# EAGLE design SECAM-TDA (EAGLE 6.4)
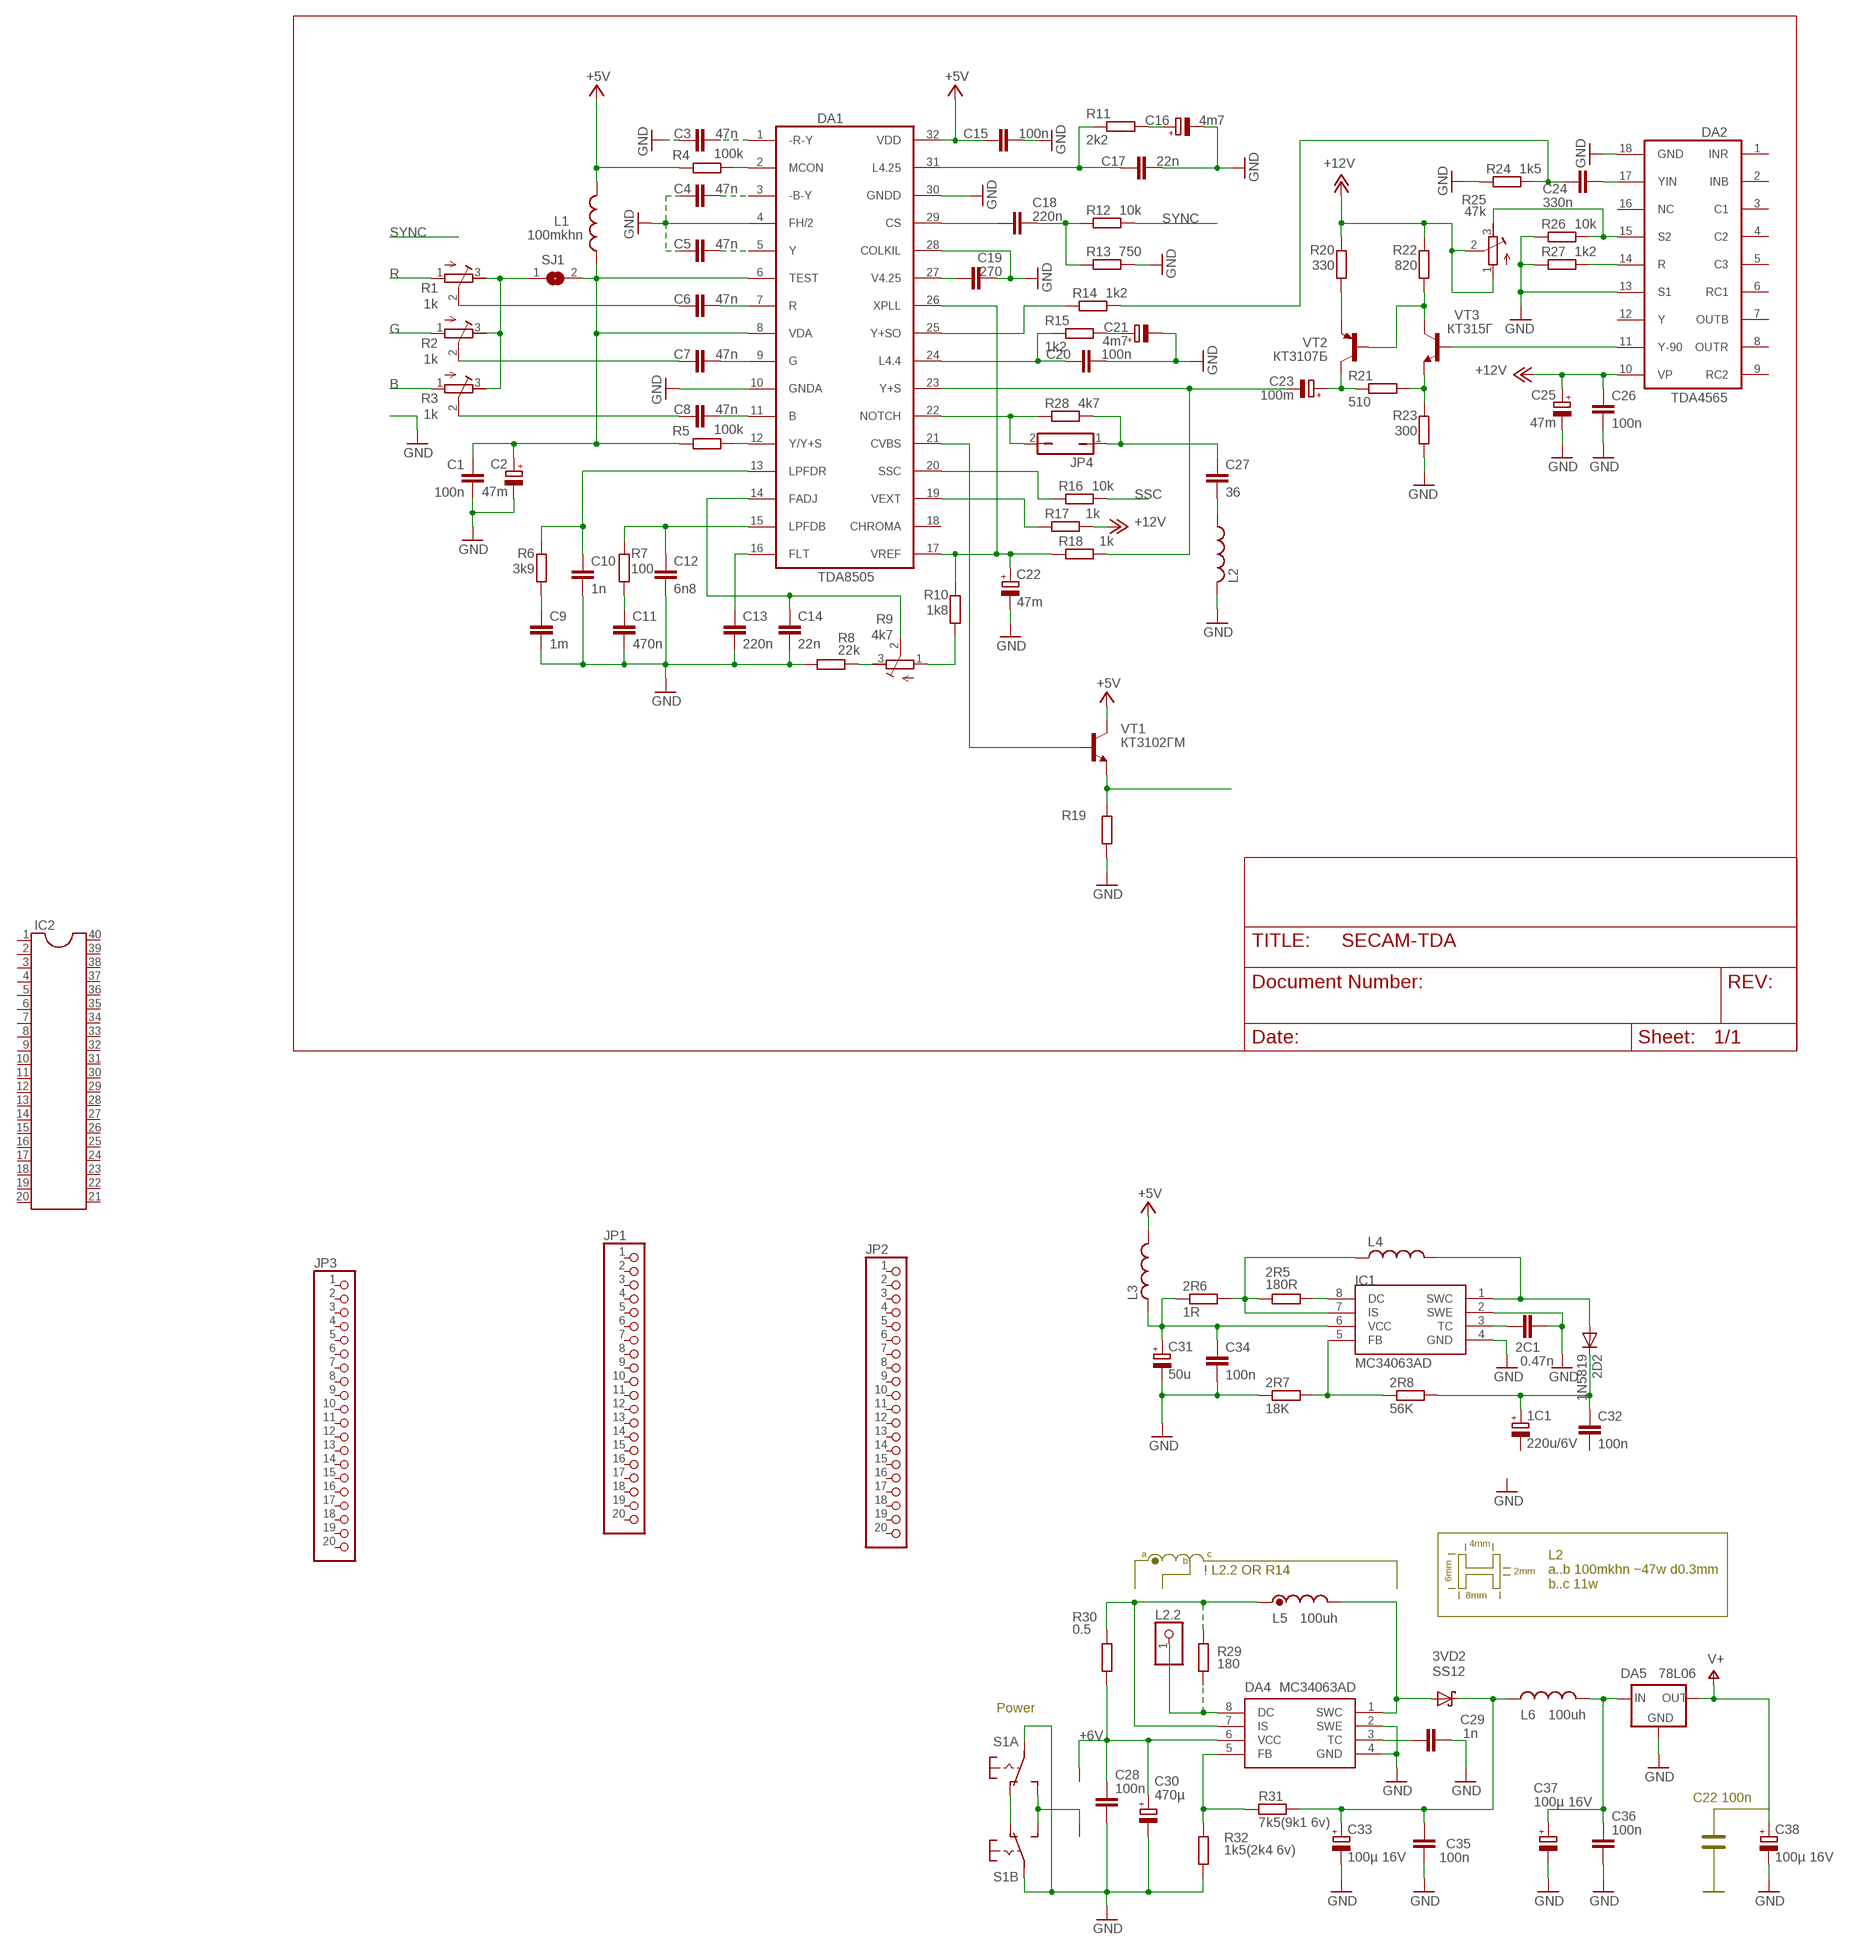
[diagram p0: schematic, sheet 1]

## Parts
1C1  220u/6V  CPOL-EUE3.5-8  [E3,5-8]
2C1  0.47n  C-EUC0805K  [C0805K]
2D2  1N5819  DIODE-SMB  [SMB]
2R5  180R  R-EU_R0805  [R0805]
2R6  1R  R-EU_R0805  [R0805]
2R7  18K  R-EU_R0805  [R0805]
2R8  56K  R-EU_R0805  [R0805]
3VD2  SS12  SCHOTTKY-DIODESMD  [SMB]
C1  100n  C-EUC0805  [C0805]
C2  47m  CPOL-EUE2.5-5  [E2,5-5]
C3  47n  C-EU025-025X050  [C025-025X050]
C4  47n  C-EU025-025X050  [C025-025X050]
C5  47n  C-EU025-025X050  [C025-025X050]
C6  47n  C-EU025-025X050  [C025-025X050]
C7  47n  C-EU025-025X050  [C025-025X050]
C8  47n  C-EU025-025X050  [C025-025X050]
C9  1m  C-EU025-025X050  [C025-025X050]
C10  1n  C-EU025-025X050  [C025-025X050]
C11  470n  C-EU025-025X050  [C025-025X050]
C12  6n8  C-EU025-025X050  [C025-025X050]
C13  220n  C-EU025-025X050  [C025-025X050]
C14  22n  C-EU025-025X050  [C025-025X050]
C15  100n  C-EUC0805  [C0805]
C16  4m7  CPOL-EUE2.5-5  [E2,5-5]
C17  22n  C-EU025-025X050  [C025-025X050]
C18  220n  C-EU025-025X050  [C025-025X050]
C19  270  C-EU025-025X050  [C025-025X050]
C20  100n  C-EUC0805  [C0805]
C21  4m7  CPOL-EUE2.5-5  [E2,5-5]
C22  47m  CPOL-EUE2.5-5  [E2,5-5]
C23  100m  CPOL-EUE2.5-5  [E2,5-5]
C24  330n  C-EU025-025X050  [C025-025X050]
C25  47m  CPOL-EUE2.5-5  [E2,5-5]
C26  100n  C-EUC0805  [C0805]
C27  36  C-EUC0805  [C0805]
C28  100n  C-EUC0805  [C0805]
C29  1n  C-EUC0805  [C0805]
C30  470µ  RCL_CPOL-EUE2.5-7  [RCL_E2,5-7]
C31  50u  CPOL-EUE2.5-6  [E2,5-6]
C32  100n  C-EUC0805K  [C0805K]
C33  100µ 16V  RCL_CPOL-EUE2.5-5  [RCL_E2,5-5]
C34  100n  C-EUC0805K  [C0805K]
C35  100n  C-EUC0805  [C0805]
C36  100n  C-EUC0805  [C0805]
C37  100µ 16V  RCL_CPOL-EUE2.5-5  [RCL_E2,5-5]
C38  100µ 16V  RCL_CPOL-EUE2.5-5  [RCL_E2,5-5]
DA1  TDA8505  [PDIP32]
DA2  TDA4565  [DIL18]
DA4  MC34063AD  [SOIC8]
DA5  78L06  78LXX_SOT89  [SOT89R]
IC1  MC34063AD  [SOIC8]
IC2  DIL40  [DIL40]
JP1  PINHD-1X20  [1X20]
JP2  PINHD-1X20  [1X20]
JP3  PINHD-1X20  [1X20]
JP4  JP1Q  [JP1]
L1  100mkhn  L-US0207/10  [0207/10]
L2  L0204/5  [0204/5]
L2.2  PINHD-1X1  [1X01]
L3  L0204/7  [0204/7]
L4  L0204/7  [0204/7]
L5  100uh  L-US0204/7  [0204/7]
L6  100uh  L-US0207/10  [0207/10]
R1  1k  R-TRIMM3296W  [RTRIM3296W]
R2  1k  R-TRIMM3296W  [RTRIM3296W]
R3  1k  R-TRIMM3296W  [RTRIM3296W]
R4  100k  R-EU_R0805  [R0805]
R5  100k  R-EU_0204/7  [0204/7]
R6  3k9  R-EU_R0805  [R0805]
R7  100  R-EU_0204/7  [0204/7]
R8  22k  R-EU_R0805  [R0805]
R9  4k7  R-TRIMM3296W  [RTRIM3296W]
R10  1k8  R-EU_R0805  [R0805]
R11  2k2  R-EU_R0805  [R0805]
R12  10k  R-EU_R0805  [R0805]
R13  750  R-EU_R0805  [R0805]
R14  1k2  R-EU_0207/10  [0207/10]
R15  1k2  R-EU_R0805  [R0805]
R16  10k  R-EU_R0805  [R0805]
R17  1k  R-EU_R0805  [R0805]
R18  1k  R-EU_R0805  [R0805]
R19  R-EU_R0805  [R0805]
R20  330  R-EU_R0805  [R0805]
R21  510  R-EU_R0805  [R0805]
R22  820  R-EU_R0805  [R0805]
R23  300  R-EU_R0805  [R0805]
R24  1k5  R-EU_R0805  [R0805]
R25  47k  R-TRIMM3296W  [RTRIM3296W]
R26  10k  R-EU_R0805  [R0805]
R27  1k2  R-EU_R0805  [R0805]
R28  4k7  R-EU_R0805  [R0805]
R29  180  R-EU_M0805  [M0805]
R30  0.5  R-EU_M1206  [M1206]
R31  7k5(9k1 6v)  R-EU_M0805  [M0805]
R32  1k5(2k4 6v)  R-EU_M0805  [M0805]
S1  SWITCH9X4  [SWITCH9X4]
SJ1  SJ  [SJ]
U$5  B-  [B-]
U$6  B+  [B+]
VT1  КТ3102ГМ  -NPN-TO92-EBC  [TO92-EBC]
VT2  КТ3107Б  BC369  [TO92-BCE]
VT3  КТ315Г  -NPN-TO92-ECB  [TO92-ECB]

## Nets
+5V: C15.1 DA1.32(VDD) L1.2 L3.2 R4.1 VT1.C
+6V: C28.1 C30.+ DA4.6(VCC) R30.1 U$6.P$1
+12V: C25.+ C26.1 DA2.10(VP) R17.2 R20.2 R22.2 R25.1(A) R25.2(S)
B: R3.1(A)
G: R2.1(A)
GND: 2C1.2 2R7.1 C1.2 C2.- C3.1 C4.1 C5.1 C9.2 C10.2 C11.2 C12.2 C13.2 C14.2 C15.2 C16.- C17.2 C19.2 C20.2 C21.- C22.- C25.- C26.2 C28.2 C29.2 C30.- C31.- C33.- C34.2 C35.1 C36.2 C37.- C38.- DA1.4(FH/2) DA1.10(GNDA) DA1.28(COLKIL) DA1.30(GNDD) DA2.13(S1) DA2.18(GND) DA4.2(SWE) DA4.4(GND) DA5.3(GND) DA5.4(GND) IC1.2(SWE) IC1.4(GND) L2.1 R8.1 R13.2 R19.1 R23.1 R24.1 R26.1 R27.1 R32.1 S1.10(A:P) S1.20(B:P)
N$1: C3.2 DA1.1(-R-Y)
N$2: DA1.2(MCON) R4.2
N$3: C24.2 DA2.17(YIN)
N$4: C4.2 DA1.3(-B-Y)
N$5: C5.2 DA1.5(Y)
N$6: C1.1 C2.+ DA1.6(TEST) DA1.8(VDA) L1.1 R5.1 SJ1.2
N$7: C6.1 R1.2(S)
N$8: C6.2 DA1.7(R)
N$9: C11.1 R7.1
N$10: C7.1 R2.2(S)
N$11: C7.2 DA1.9(G)
N$12: C8.2 DA1.11(B)
N$13: C8.1 R3.2(S)
N$14: DA1.12(Y/Y+S) R5.2
N$15: C13.1 DA1.16(FLT)
N$16: C10.1 DA1.13(LPFDR) R6.2
N$17: R8.2 R9.3(E)
N$18: C9.1 R6.1
N$19: C12.1 DA1.15(LPFDB) R7.2
N$20: C14.1 DA1.14(FADJ) R9.2(S)
N$21: C22.+ DA1.17(VREF) DA1.26(XPLL) R10.2 R18.1
N$22: C19.1 DA1.27(V4.25)
N$23: R9.1(A) R10.1
N$25: DA1.19(VEXT) R17.1
N$26: DA1.20(SSC) R16.1
N$27: DA1.21(CVBS) VT1.B
N$28: C23.- DA1.23(Y+S) R18.2
N$29: C20.1 DA1.24(L4.4) R15.1
N$30: C21.+ R15.2
N$31: C17.1 DA1.31(L4.25) R11.1
N$32: C24.1 R14.2 R24.2
N$33: DA1.25(Y+SO) R14.1
N$34: C16.+ R11.2
N$35: DA2.14(R) R27.2
N$36: DA2.15(S2) R25.3(E) R26.2
N$37: C18.1 DA1.29(CS)
N$38: C18.2 R12.1 R13.1
N$39: DA2.11(Y-90) VT3.B
N$40: R22.1 VT2.B VT3.C
N$41: R20.1 VT2.E
N$43: R21.2 R23.2 VT3.E
N$44: C23.+ R21.1 VT2.C
N$45: R19.2 VT1.E
N$47: C27.1 JP4.1 R28.2
N$48: R1.3(E) R2.3(E) R3.3(E) SJ1.1
N$49: DA1.22(NOTCH) JP4.2 R28.1
N$50: 2C1.1 IC1.3(TC)
N$51: 2D2.A IC1.1(SWC) L4.2
N$52: 2R5.1 2R6.2 IC1.7(IS) L4.1
N$53: 2R5.2 IC1.8(DC)
N$54: 2R7.2 2R8.1 IC1.5(FB)
N$55: DA4.8(DC) L2.2.1 R29.1
N$56: 1C1.+ 2D2.C 2R8.2 C32.1
N$57: 2R6.1 C31.+ C34.1 IC1.6(VCC) L3.1
N$58: C27.2 L2.2
N$59: DA4.7(IS) L5.1 R29.2 R30.2
N$60: DA4.5(FB) R31.1 R32.2
N$61: 3VD2.A DA4.1(SWC) L5.2
N$62: C29.1 DA4.3(TC)
N$63: 3VD2.C C33.+ C35.2 L6.1 R31.2
N$64: S1.12(A:S) S1.22(B:S) U$5.P$1
N$65: S1.11(A:O) S1.21(B:O)
N$66: C36.1 C37.+ DA5.1(IN) L6.2
R: R1.1(A)
SSC: R16.2
SYNC: R12.2
V+: C38.+ DA5.2(OUT)
Unconnected: 1C1.- C32.2 DA1.18(CHROMA) DA2.1(INR) DA2.2(INB) DA2.3(C1) DA2.4(C2) DA2.5(C3) DA2.6(RC1) DA2.7(OUTB) DA2.8(OUTR) DA2.9(RC2) DA2.12(Y) DA2.16(NC) IC2.1 IC2.2 IC2.3 IC2.4 IC2.5 IC2.6 IC2.7 IC2.8 IC2.9 IC2.10 IC2.11 IC2.12 IC2.13 IC2.14 IC2.15 IC2.16 IC2.17 IC2.18 IC2.19 IC2.20 IC2.21 IC2.22 IC2.23 IC2.24 IC2.25 IC2.26 IC2.27 IC2.28 IC2.29 IC2.30 IC2.31 IC2.32 IC2.33 IC2.34 IC2.35 IC2.36 IC2.37 IC2.38 IC2.39 IC2.40 JP1.1 JP1.2 JP1.3 JP1.4 JP1.5 JP1.6 JP1.7 JP1.8 JP1.9 JP1.10 JP1.11 JP1.12 JP1.13 JP1.14 JP1.15 JP1.16 JP1.17 JP1.18 JP1.19 JP1.20 JP2.1 JP2.2 JP2.3 JP2.4 JP2.5 JP2.6 JP2.7 JP2.8 JP2.9 JP2.10 JP2.11 JP2.12 JP2.13 JP2.14 JP2.15 JP2.16 JP2.17 JP2.18 JP2.19 JP2.20 JP3.1 JP3.2 JP3.3 JP3.4 JP3.5 JP3.6 JP3.7 JP3.8 JP3.9 JP3.10 JP3.11 JP3.12 JP3.13 JP3.14 JP3.15 JP3.16 JP3.17 JP3.18 JP3.19 JP3.20

## Notes on the sheet
- 4mm
- a | c
- b
- ! L2.2 OR R14 | 2mm
- 6mm
- L2 
  a..b 100mkhn ~47w d0.3mm
  b..c 11w
- 8mm
- Power
- C22 100n

## Library data of the parts
1C1 C31 = resistor:CPOL-EU: POLARIZED CAPACITOR, European symbol
2C1 C32 C34 = resistor:C-EU: CAPACITOR, European symbol
2D2 = diode:DIODE-: DIODE
2R5-2R8 = resistor:R-EU_: RESISTOR, European symbol
3VD2 = diode:SCHOTTKY-DIODE: Schottky Diode
C1 C3-C15 C17-C20 C24 C26 C27 C29 C35 C36 = rcl:C-EU: CAPACITOR, European symbol
C2 C16 C21-C23 C25 = rcl:CPOL-EU: POLARIZED CAPACITOR, European symbol
C28 = rc-elektronik:C-EU: CAPACITOR, European symbol
C30 C33 C37 C38 = HWProgUSB:RCL_CPOL-EU: POLARIZED CAPACITOR, European symbol
DA1 = TDA8505:TDA8505
DA2 = TDA8505:TDA4565
DA4 IC1 = mc34063:MC34063
DA5 = ct-pack:78LXX: VOLTAGE REGULATOR
IC2 = ic-package:DIL40: Dual In Line
JP1-JP3 = Разъёмы штырьковые 2.54мм:PINHD-1X20: PIN HEADER
JP4 = jumper:JP1Q: JUMPER
L1 L5 L6 = rcl:L-US: INDUCTOR, American symbol
L2-L4 = rcl:L: INDUCTOR, American symbol
L2.2 = pinhead:PINHD-1X1: PIN HEADER
R1-R3 R9 R25 = rcl:R-TRIMM: Trimm resistor
R4-R8 R10-R24 R26-R32 = rcl:R-EU_: RESISTOR, European symbol
S1 = ESR_NM8032:SWITCH9X4
SJ1 = jumper:SJ: SMD solder JUMPER
U$5 = ESR_NM8032:B-
U$6 = ESR_NM8032:B+
VT1 VT3 = transistor:*-NPN-: NPN Transistror BF959 corrected 2008.03.06
VT2 = transistor-pnp:BC369*: PNP Transistror

## Board
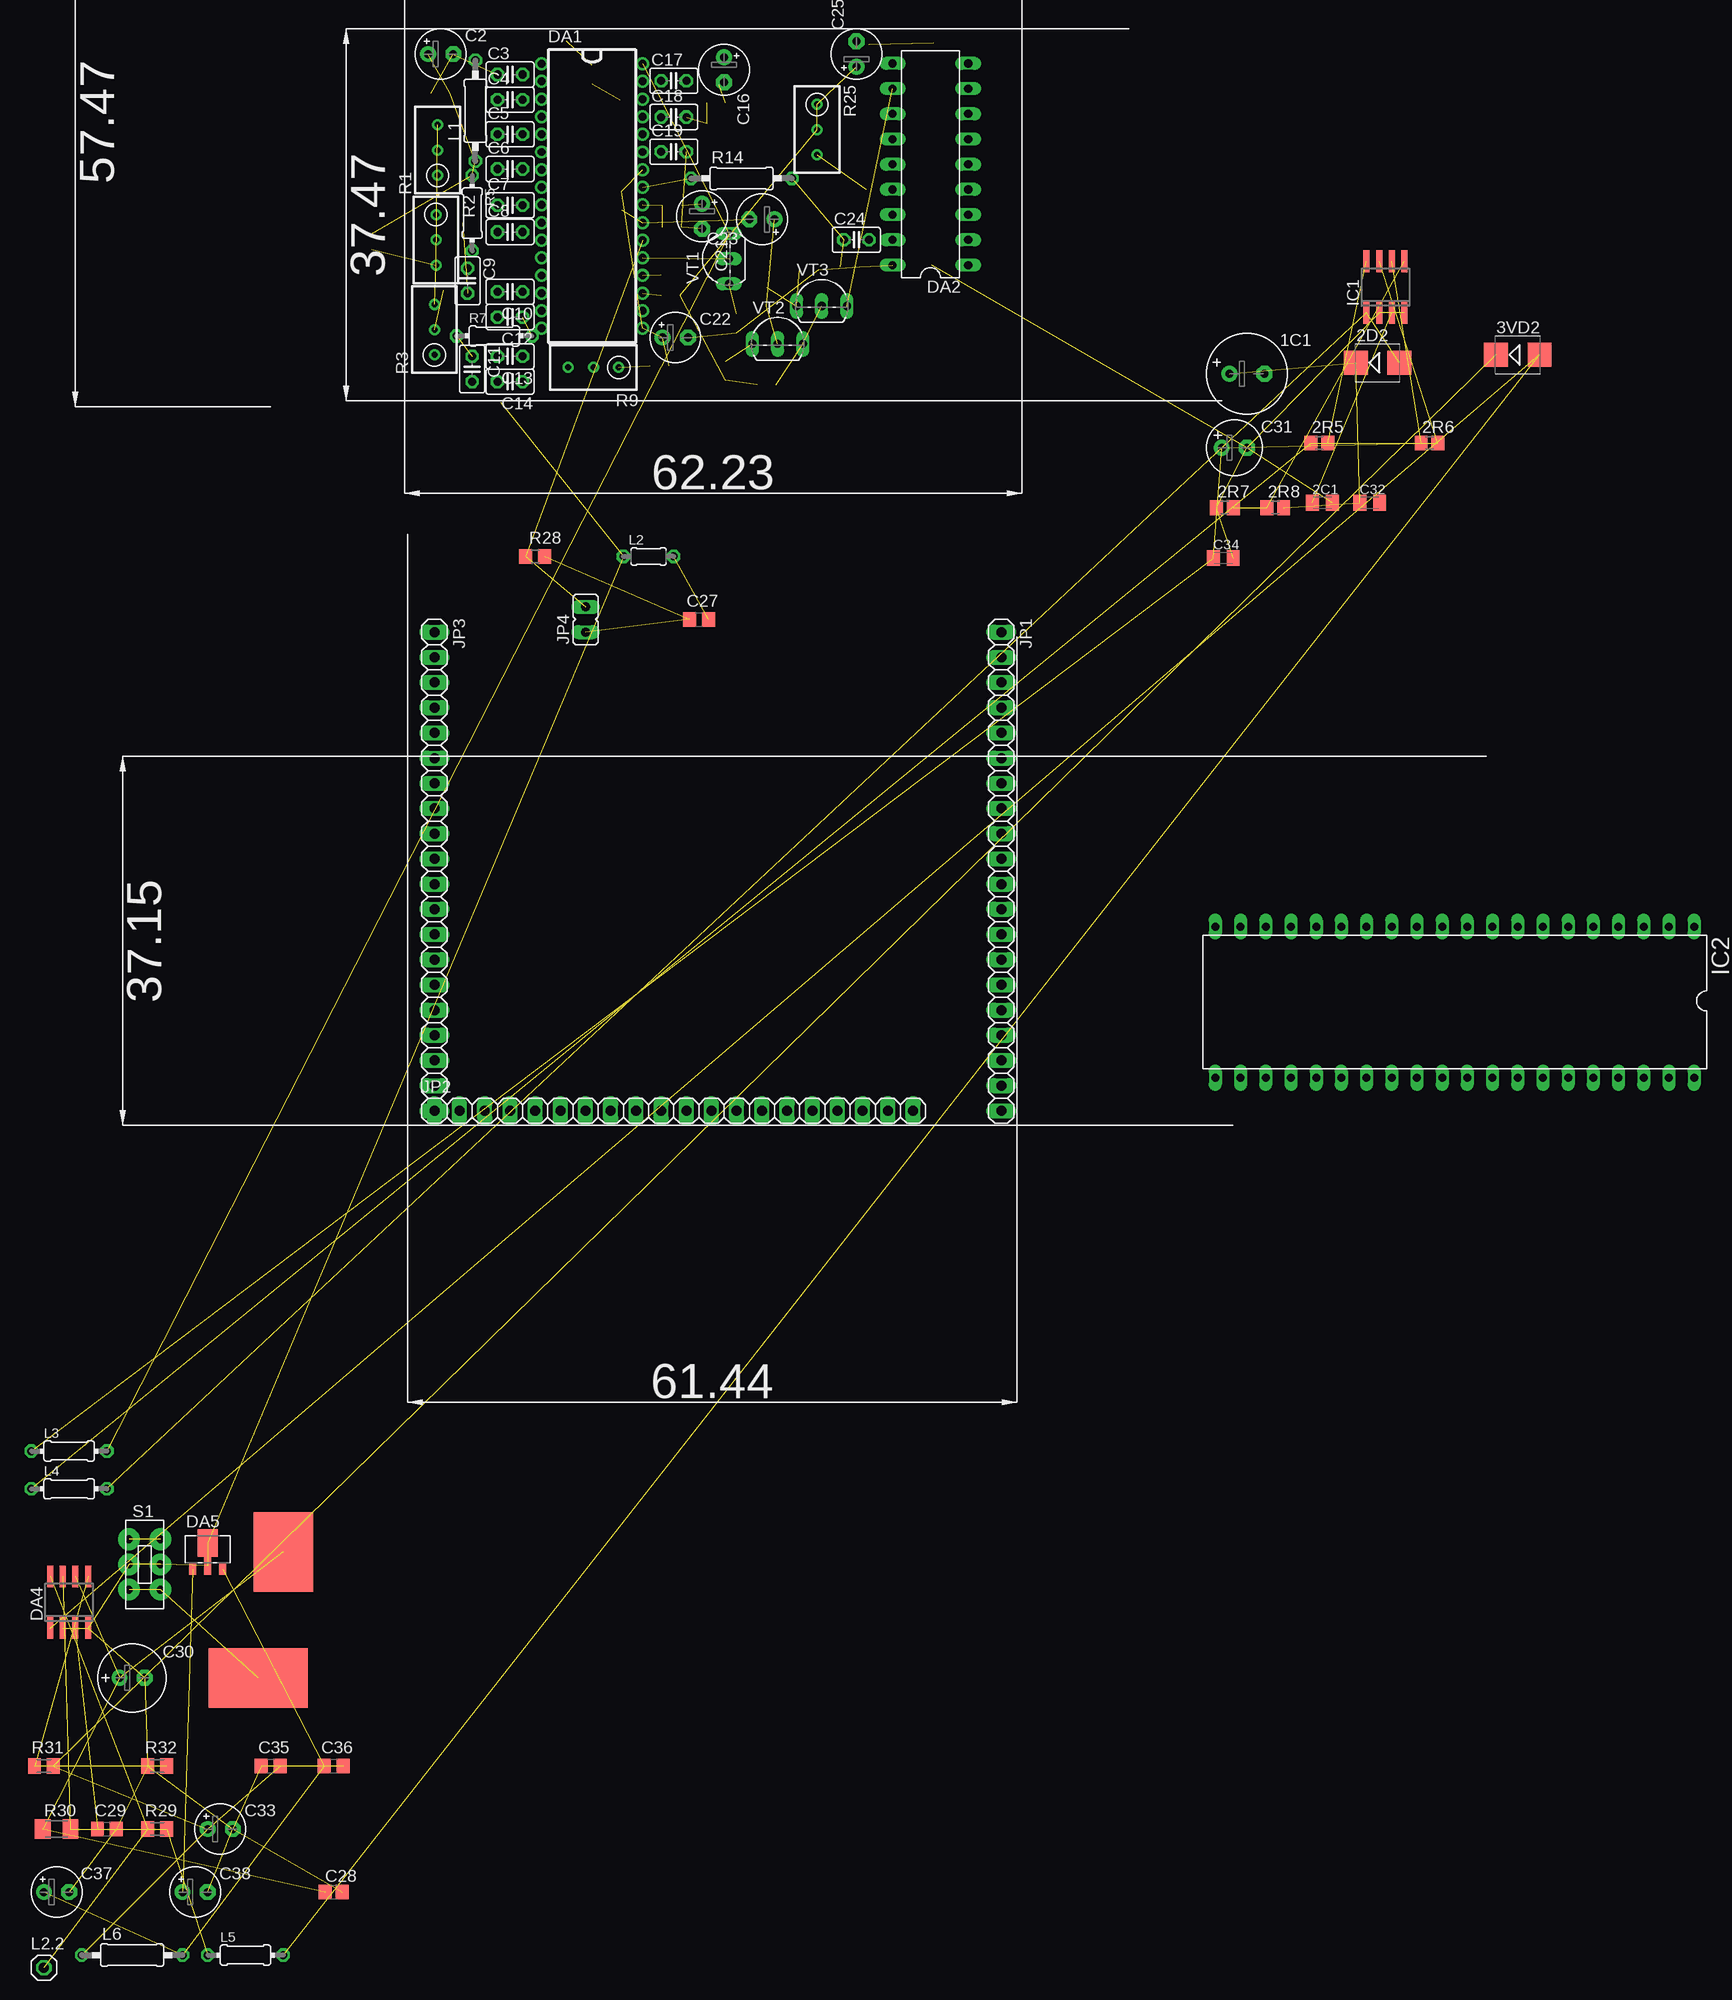
[diagram p1: board, top side]
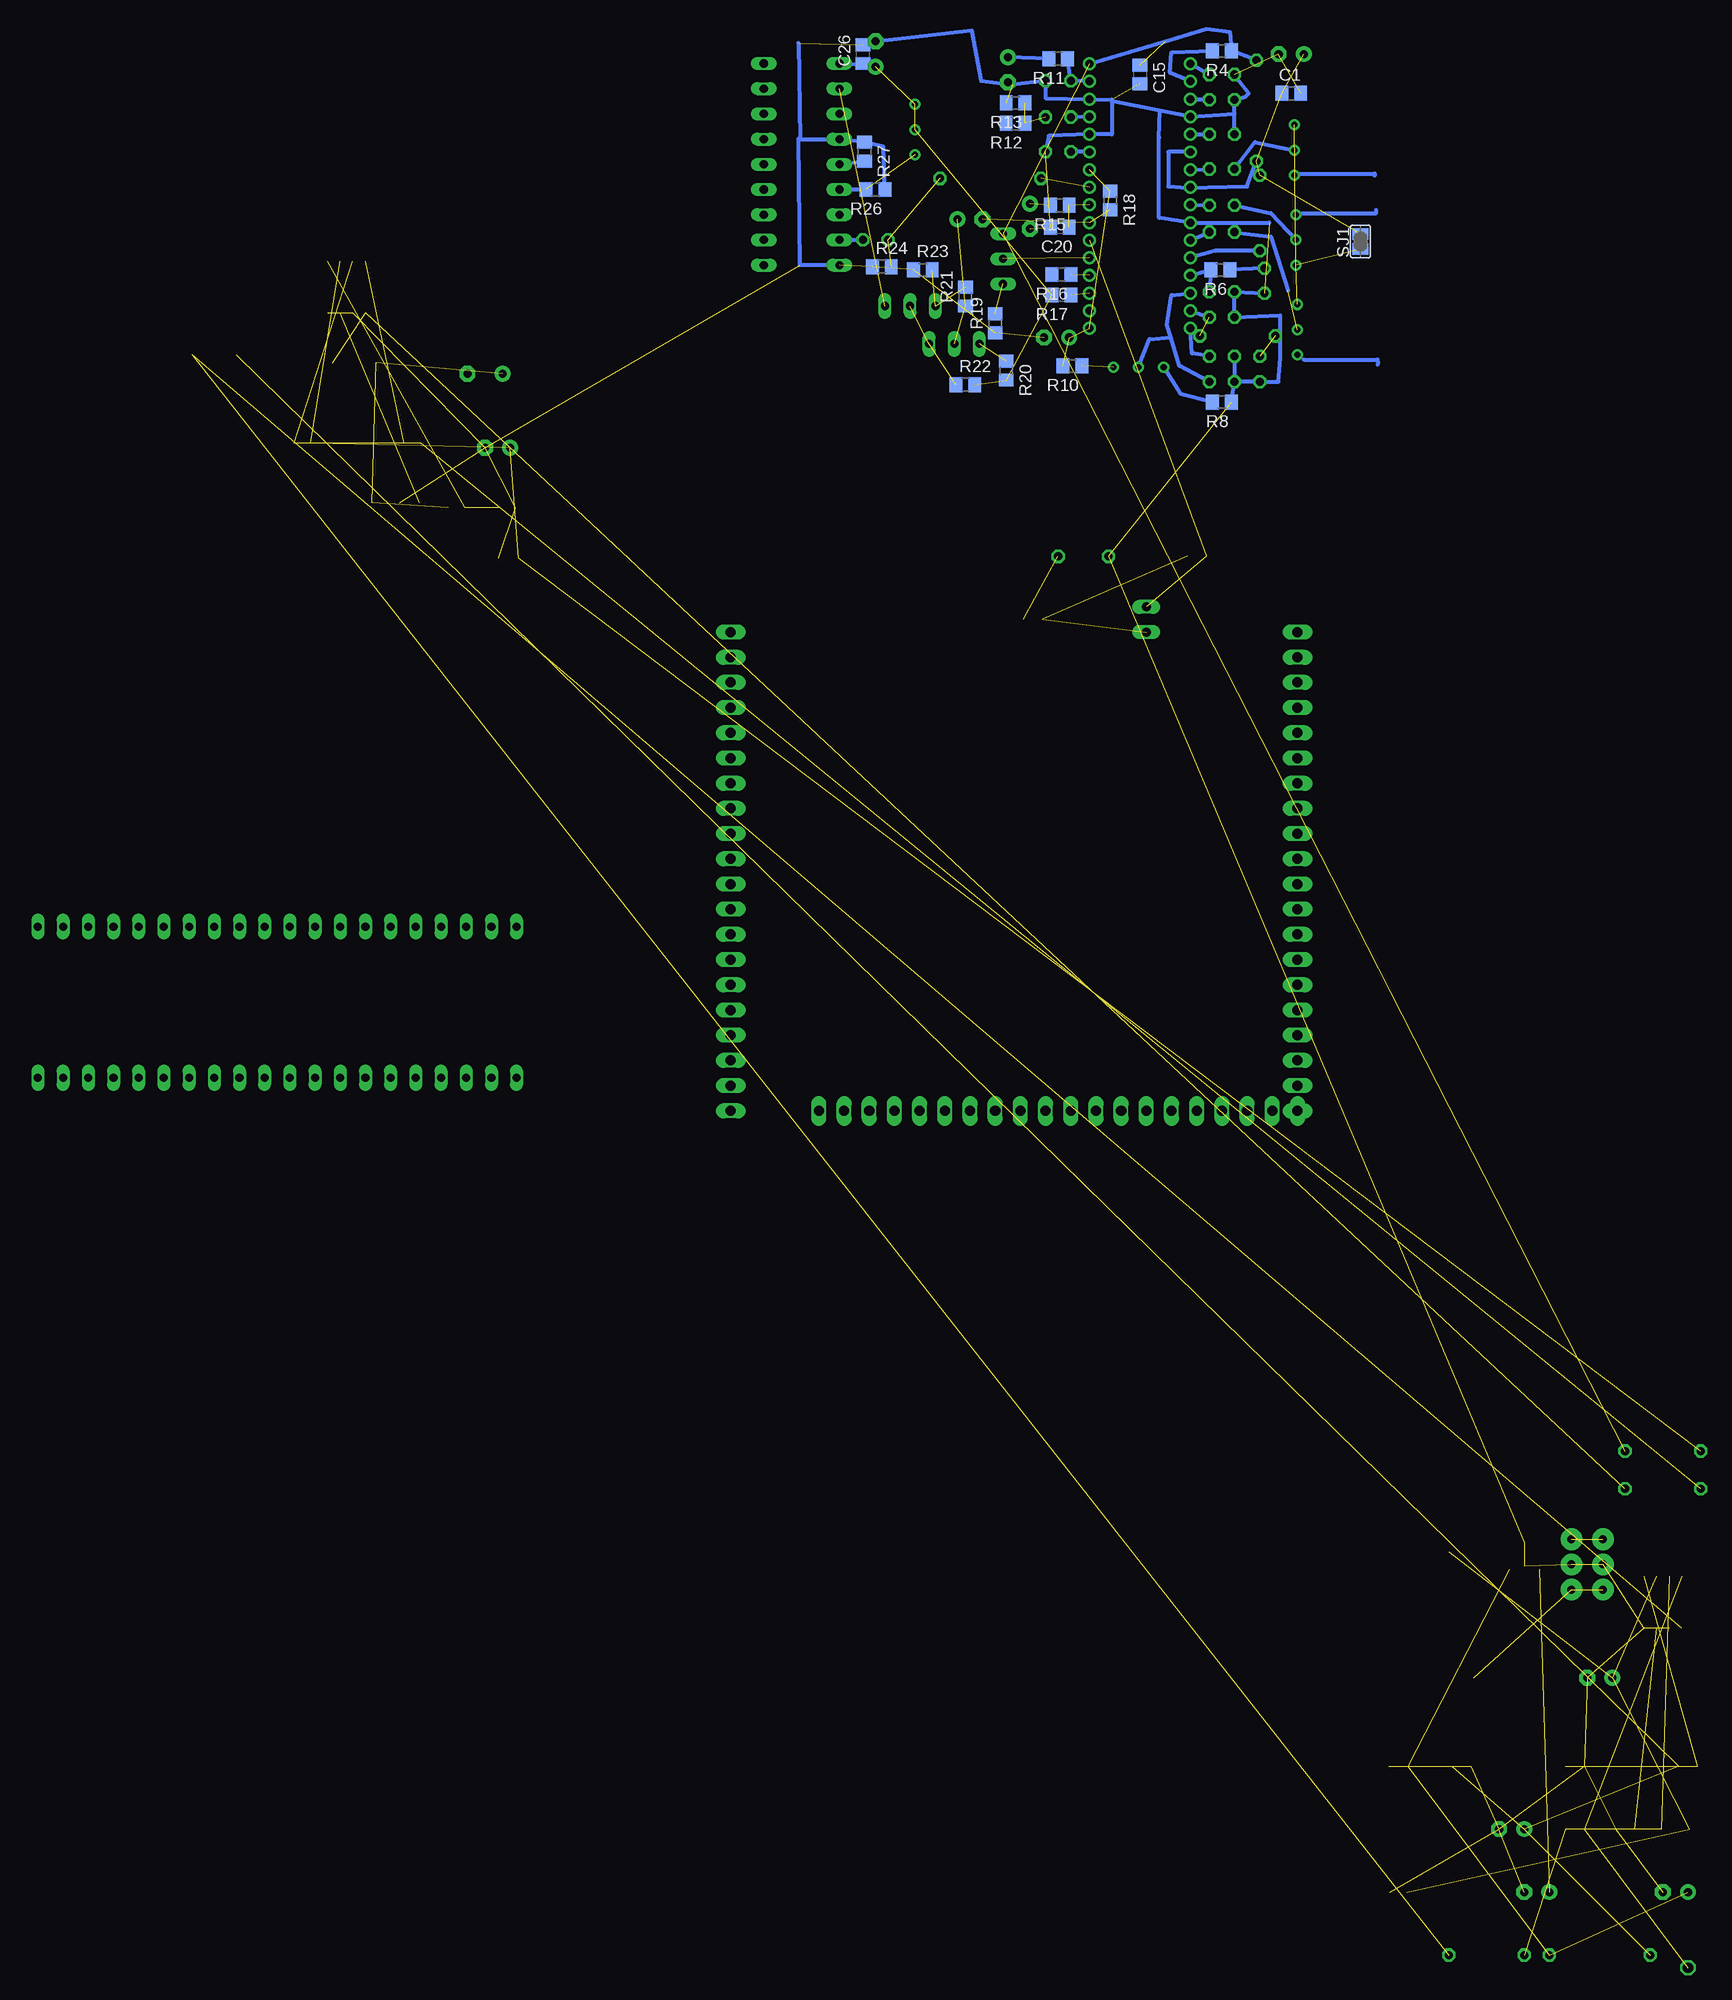
[diagram p2: board, bottom side, seen from below]

No outline drawn. Coordinates in mm, seen from the top.
Copper layers (1*16): Top 0.035mm / dielectric 1.5mm / Bottom 0.035mm
Design rules "default": minimum track width 10mil, minimum drill 24mil, track to track 8mil, track to pad 8mil, pad to pad 8mil, via to via 8mil, smd to smd 8mil, copper to edge 40mil, drill to drill 8mil, minimum pad ring 10mil, minimum via ring 8mil, stop-mask expansion 4mil, vias tented up to drill 0mil, thermal gap 10mil

### Footprints (pad centres in the part's own frame; a part is rotated, then mirrored left to right if it is on the bottom)
E3,5-8 = drill 0.813 pad 1.6: + -1.778,0 | drill 0.813 pad 1.6 octagon: - 1.778,0
C0805K = smd 1.3 x 1.6: 1 -1,0; 2 1,0
SMB = smd 2.4 x 2.4: A 2.2,0; C -2.2,0
R0805 = smd 1.3 x 1.5: 1 -0.85,0; 2 0.85,0
C0805 = smd 1.3 x 1.5: 1 -0.95,0; 2 0.95,0
E2,5-5 = drill 0.813 pad 1.6: + -1.27,0 | drill 0.813 pad 1.6 octagon: - 1.27,0
C025-025X050 = drill 0.813 octagon: 1 -1.27,0; 2 1.27,0
C0805' = smd 1.3 x 1.5: 1 -0.85,0; 2 0.85,0
RCL_E2,5-7 = drill 0.813 pad 1.6: + -1.27,0 | drill 0.813 pad 1.6 octagon: - 1.27,0
E2,5-6 = drill 0.813 pad 1.6: + -1.27,0 | drill 0.813 pad 1.6 octagon: - 1.27,0
RCL_E2,5-5 = drill 0.813 pad 1.6: + -1.27,0 | drill 0.813 pad 1.6 octagon: - 1.27,0
PDIP32 = drill 0.8 pad 1.27: 1 -12.827,-5.08; 2 -11.049,-5.08; 3 -9.271,-5.08; 4 -7.493,-5.08; 5 -5.715,-5.08; 6 -3.937,-5.08; 7 -2.159,-5.08; 8 -0.381,-5.08; 9 1.397,-5.08; 10 3.175,-5.08; 11 4.953,-5.08; 12 6.731,-5.08; 13 8.509,-5.08; 14 10.287,-5.08; 15 12.065,-5.08; 16 13.843,-5.08; 17 13.843,5.12; 18 12.065,5.12; 19 10.287,5.12; 20 8.509,5.12; 21 6.731,5.12; 22 4.953,5.12; 23 3.175,5.12; 24 1.397,5.12; 25 -0.381,5.12; 26 -2.159,5.12; 27 -3.937,5.12; 28 -5.715,5.12; 29 -7.493,5.12; 30 -9.271,5.12; 31 -11.049,5.12; 32 -12.827,5.12
DIL18 = drill 0.813 long: 1 -10.16,-3.81; 2 -7.62,-3.81; 3 -5.08,-3.81; 4 -2.54,-3.81; 5 0,-3.81; 6 2.54,-3.81; 7 5.08,-3.81; 8 7.62,-3.81; 9 10.16,-3.81; 10 10.16,3.81; 11 7.62,3.81; 12 5.08,3.81; 13 2.54,3.81; 14 0,3.81; 15 -2.54,3.81; 16 -5.08,3.81; 17 -7.62,3.81; 18 -10.16,3.81
SOIC8 = smd 0.6 x 2.2: 1 -1.905,-2.6; 2 -0.635,-2.6; 3 0.635,-2.6; 4 1.905,-2.6; 5 1.905,2.6; 6 0.635,2.6; 7 -0.635,2.6; 8 -1.905,2.6
SOT89R = smd 0.7 x 1.1: 1 1.5,-1.75; 2 -1.5,-1.75 | smd 0.7 x 1.8: 3 0,-1.4 | smd 2 x 2.8: 4 0,0.9
DIL40 = drill 0.813 long: 1 -24.13,-7.62; 2 -21.59,-7.62; 3 -19.05,-7.62; 4 -16.51,-7.62; 5 -13.97,-7.62; 6 -11.43,-7.62; 7 -8.89,-7.62; 8 -6.35,-7.62; 9 -3.81,-7.62; 10 -1.27,-7.62; 11 1.27,-7.62; 12 3.81,-7.62; 13 6.35,-7.62; 14 8.89,-7.62; 15 11.43,-7.62; 16 13.97,-7.62; 17 16.51,-7.62; 18 19.05,-7.62; 19 21.59,-7.62; 20 24.13,-7.62; 21 24.13,7.62; 22 21.59,7.62; 23 19.05,7.62; 24 16.51,7.62; 25 13.97,7.62; 26 11.43,7.62; 27 8.89,7.62; 28 6.35,7.62; 29 3.81,7.62; 30 1.27,7.62; 31 -1.27,7.62; 32 -3.81,7.62; 33 -6.35,7.62; 34 -8.89,7.62; 35 -11.43,7.62; 36 -13.97,7.62; 37 -16.51,7.62; 38 -19.05,7.62; 39 -21.59,7.62; 40 -24.13,7.62
1X20 = drill 1.016 long: 1 -24.13,0; 2 -21.59,0; 3 -19.05,0; 4 -16.51,0; 5 -13.97,0; 6 -11.43,0; 7 -8.89,0; 8 -6.35,0; 9 -3.81,0; 10 -1.27,0; 11 1.27,0; 12 3.81,0; 13 6.35,0; 14 8.89,0; 15 11.43,0; 16 13.97,0; 17 16.51,0; 18 19.05,0; 19 21.59,0; 20 24.13,0
JP1 = drill 0.914 long: 1 0,-1.27; 2 0,1.27
0207/10 = drill 0.813 octagon: 1 -5.08,0; 2 5.08,0
0204/5 = drill 0.813 octagon: 1 -2.54,0; 2 2.54,0
1X01 = drill 1.016 octagon: 1 0,0
0204/7 = drill 0.813 octagon: 1 -3.81,0; 2 3.81,0
RTRIM3296W = drill 0.61: 1 0,-2.54; 2 0,0; 3 0,2.54
R0805' = smd 1.3 x 1.5: 1 -0.95,0; 2 0.95,0
M0805 = smd 1.3 x 1.6: 1 -0.95,0; 2 0.95,0
M1206 = smd 1.6 x 2: 1 -1.4,0; 2 1.4,0
SWITCH9X4 = drill 0.8 pad 2.184: 10 -1.587,0; 11 -1.587,2.54; 12 -1.587,-2.54; 20 1.587,0; 21 1.587,2.54; 22 1.587,-2.54
SJ = smd 1.168 x 1.6: 1 -0.762,0; 2 0.762,0
B- = smd 10 x 6: P$1 0,0
B+ = smd 6 x 8: P$1 0,0
TO92-EBC = drill 0.813 long: B 0,-1.27; C 2.54,-1.27; E -2.54,-1.27
TO92-BCE = drill 0.813 long: B 2.54,0; C 0,0; E -2.54,0
TO92-ECB = drill 0.813 long: B 2.54,0; C 0,0; E -2.54,0

### Placement (x,y rotation side)
1C1  98.42,24.77 0 top
2C1  106.05,11.75 0 top
2D2  111.6,25.88 0 top
2R5  105.73,17.78 0 top
2R6  116.84,17.78 0 top
2R7  96.2,11.27 0 top
2R8  101.28,11.27 0 top
3VD2  125.73,26.67 0 top
C1  17.14,53.02 0 bottom
C2  17.14,56.99 0 top
C3  24.13,54.93 0 top
C4  24.13,52.39 0 top
C5  24.13,48.9 0 top
C6  24.13,45.4 0 top
C7  24.13,41.75 0 top
C8  24.13,39.05 0 top
C9  19.84,34.13 270 top
C10  24.13,33.02 180 top
C11  20.32,25.24 270 top
C12  24.13,30.48 180 top
C13  24.13,26.51 180 top
C14  24.13,23.97 180 top
C15  32.38,54.93 270 bottom
C16  45.72,55.4 270 top
C17  40.64,54.29 0 top
C18  40.64,50.64 0 top
C19  40.64,47.15 0 top
C20  40.48,39.53 180 bottom
C21  43.5,40.64 270 top
C22  40.8,28.42 0 top
C23  49.53,40.32 180 top
C24  59.05,38.26 0 top
C25  59.05,56.99 90 top
C26  60.33,56.99 90 bottom
C27  43.18,0 0 top
C28  100n  [C0805']  6.35,-128.27 0 top
C29  -16.51,-121.92 0 top
C30  -13.97,-106.68 0 top
C31  97.16,17.3 0 top
C32  110.81,11.75 0 top
C33  -5.08,-121.92 0 top
C34  96.04,6.19 0 top
C35  0,-115.57 0 top
C36  6.35,-115.57 0 top
C37  -21.59,-128.27 0 top
C38  -7.62,-128.27 0 top
DA1  32.38,43.18 270 top
DA2  66.52,45.88 90 top
DA4  -20.32,-99.06 0 top
DA5  -6.35,-93.98 0 top
IC1  112.39,33.5 0 top
IC2  119.38,-38.58 180 top
JP1  73.66,-25.4 270 top
JP2  40.64,-49.53 0 top
JP3  16.51,-25.4 270 top
JP4  31.75,0 0 top
L1  20.64,51.28 90 top
L2  38.1,6.35 0 top
L2.2  -22.86,-135.89 0 top
L3  -20.32,-83.82 0 top
L4  -20.32,-87.63 0 top
L5  -2.54,-134.62 0 top
L6  -13.97,-134.62 0 top
R1  16.83,47.31 0 top
R2  16.67,38.26 180 top
R3  16.51,29.21 0 top
R4  100k  [R0805']  24.13,57.31 180 bottom
R5  20.32,40.96 270 top
R6  3k9  [R0805']  24.29,35.24 180 bottom
R7  22.54,28.57 0 top
R8  22k  [R0805']  24.13,21.91 180 bottom
R9  32.54,25.4 90 top
R10  1k8  [R0805']  39.21,25.56 180 bottom
R11  2k2  [R0805']  40.64,56.52 180 bottom
R12  10k  [R0805']  44.93,50.01 180 bottom
R13  750  [R0805']  44.93,52.07 180 bottom
R14  47.47,44.45 0 top
R15  1k2  [R0805']  40.48,41.75 180 bottom
R16  10k  [R0805']  40.32,34.77 180 bottom
R17  1k  [R0805']  40.32,32.7 180 bottom
R18  1k  [R0805']  35.4,42.23 270 bottom
R19  [R0805']  46.99,29.84 90 bottom
R20  330  [R0805']  45.88,25.08 270 bottom
R21  510  [R0805']  50.01,32.54 90 bottom
R22  820  [R0805']  50.01,23.65 0 bottom
R23  300  [R0805']  54.29,35.24 0 bottom
R24  1k5  [R0805']  58.42,35.56 0 bottom
R25  55.09,49.37 180 top
R26  10k  [R0805']  59.05,43.34 180 bottom
R27  1k2  [R0805']  60.17,47.15 270 bottom
R28  4k7  [R0805']  26.67,6.35 0 top
R29  -11.43,-121.92 0 top
R30  -21.59,-121.92 0 top
R31  -22.86,-115.57 0 top
R32  -11.43,-115.57 0 top
S1  -12.7,-95.25 0 top
SJ1  10.16,38.1 90 bottom
U$5  -1.27,-106.68 0 top
U$6  1.27,-93.98 0 top
VT1  44.93,36.35 90 top
VT2  51.12,27.78 0 top
VT3  55.56,31.59 0 top

### Tracks (layer width: path | path; a pad name or v marks a point on that pad's centre or on a via)
+5V  (3 unrouted)
  Bottom 0.406: L1.2 R4.1 23.34,59.21 25.72,59.53 29.84,58.26 DA1.32
+6V  (4 unrouted)
+12V  (5 unrouted)
  Bottom 0.406: DA2.10 C25.+ C26.1
GND  (34 unrouted)
  Bottom 0.406: 22.86,50.99 DA1.4 30.39,51.28 | 22.86,50.99 C4.1 21.75,52.7 21.43,53.02 C3.1 | C5.1 22.86,50.99 | 35.24,52.23 35.24,52.39 DA1.30 41.91,52.55 C17.2 45.21,53.88 | 35.24,52.23 35.24,48.9 DA1.28 41.59,48.74 C19.2 | 45.21,53.88 C16.- | DA2.18 66.67,35.72 66.83,48.42 66.67,48.42 | 66.67,48.42 DA2.13 R27.1 58.26,47.62 R26.1 | 66.83,58.1 66.67,48.42 | C26.2 C25.- 49.37,59.37 48.42,54.29 45.21,53.88 | C13.2 C14.2 | R8.1 C14.2 | C9.2 C10.2 C12.2 18.26,30.64 18.26,26.35 18.41,23.97 C11.2 C14.2 | 19.37,40.01 DA1.10 30.48,40.48 30.48,48.58 30.39,51.28 | 30.39,51.28 35.24,52.23
N$1
  Bottom 0.406: DA1.1 C3.2
N$2
  Bottom 0.406: DA1.2 29.37,55.09 29.21,57.15 R4.2
N$3
  Bottom 0.406: DA2.17 C24.2
N$4
  Bottom 0.406: DA1.3 25.4,52.45 C4.2
N$5
  Bottom 0.406: DA1.5 C5.2
N$6  (4 unrouted)
  Bottom 0.406: DA1.6 29.53,47.12 29.53,43.66 27.62,43.5 | 27.62,43.5 DA1.8 | 27.62,43.5 21.59,43.66 L1.1
N$7
  Bottom 0.406: C6.1 20.8,48.1 R1.2
N$8
  Bottom 0.406: DA1.7 C6.2
N$9  (1 unrouted)
N$10
  Bottom 0.406: C7.1 19.21,40.96 R2.2
N$11
  Bottom 0.406: DA1.9 C7.2
N$12
  Bottom 0.406: DA1.11 C8.2
N$13  (1 unrouted)
  Bottom 0.406: C8.1 19.21,38.58 17.46,33.18
N$14
  Bottom 0.406: R5.2 24.77,37.15 DA1.12
N$15
  Bottom 0.406: C13.1 27.15,26.83 DA1.16
N$16
  Bottom 0.406: DA1.13 R6.2 C10.1
N$17
  Bottom 0.406: R8.2 28.26,22.7 R9.3
N$18
  Bottom 0.406: C9.1 R6.1
N$19  (1 unrouted)
  Bottom 0.406: DA1.15 C12.1
N$20
  Bottom 0.406: C14.1 28.42,25.56 29.3,28.43 | 29.3,28.43 29.69,29.69 29.21,32.7 DA1.14 | R9.2 31.43,28.26 29.3,28.43
N$21  (4 unrouted)
N$22
  Bottom 0.406: DA1.27 C19.1
N$23  (1 unrouted)
N$24
  Bottom 0.406: 16.67,40.96 8.57,40.96 8.57,41.27
N$25  (1 unrouted)
N$26  (1 unrouted)
N$27  (1 unrouted)
N$28  (2 unrouted)
N$29  (2 unrouted)
N$30  (1 unrouted)
N$31
  Bottom 0.406: DA1.31 C17.1 R11.1
N$32  (2 unrouted)
N$33  (1 unrouted)
N$34
  Bottom 0.406: R11.2 C16.+
N$35
  Bottom 0.406: DA2.14 R27.2
N$36  (1 unrouted)
  Bottom 0.406: DA2.15 R26.2
N$37
  Bottom 0.406: DA1.29 C18.1
N$38  (2 unrouted)
N$39  (1 unrouted)
N$40  (2 unrouted)
N$41  (1 unrouted)
N$42
  Bottom 0.406: 16.99,44.93 8.73,44.93 8.73,44.77
N$43  (2 unrouted)
N$44  (2 unrouted)
N$45  (1 unrouted)
N$46
  Bottom 0.406: 15.88,26.19 8.41,26.19 8.41,26.04 8.41,25.72
N$47  (2 unrouted)
N$48  (3 unrouted)
N$49  (2 unrouted)
N$50  (1 unrouted)
N$51  (2 unrouted)
N$52  (3 unrouted)
N$53  (1 unrouted)
N$54  (2 unrouted)
N$55  (2 unrouted)
N$56  (3 unrouted)
N$57  (4 unrouted)
N$58  (1 unrouted)
N$59  (3 unrouted)
N$60  (2 unrouted)
N$61  (2 unrouted)
N$62  (1 unrouted)
N$63  (4 unrouted)
N$64  (2 unrouted)
N$65  (1 unrouted)
N$66  (3 unrouted)
V+  (1 unrouted)